# Altium schematic sheet Sheet_1_2024-01-01 (1).schdoc
size 310 x 219 mm
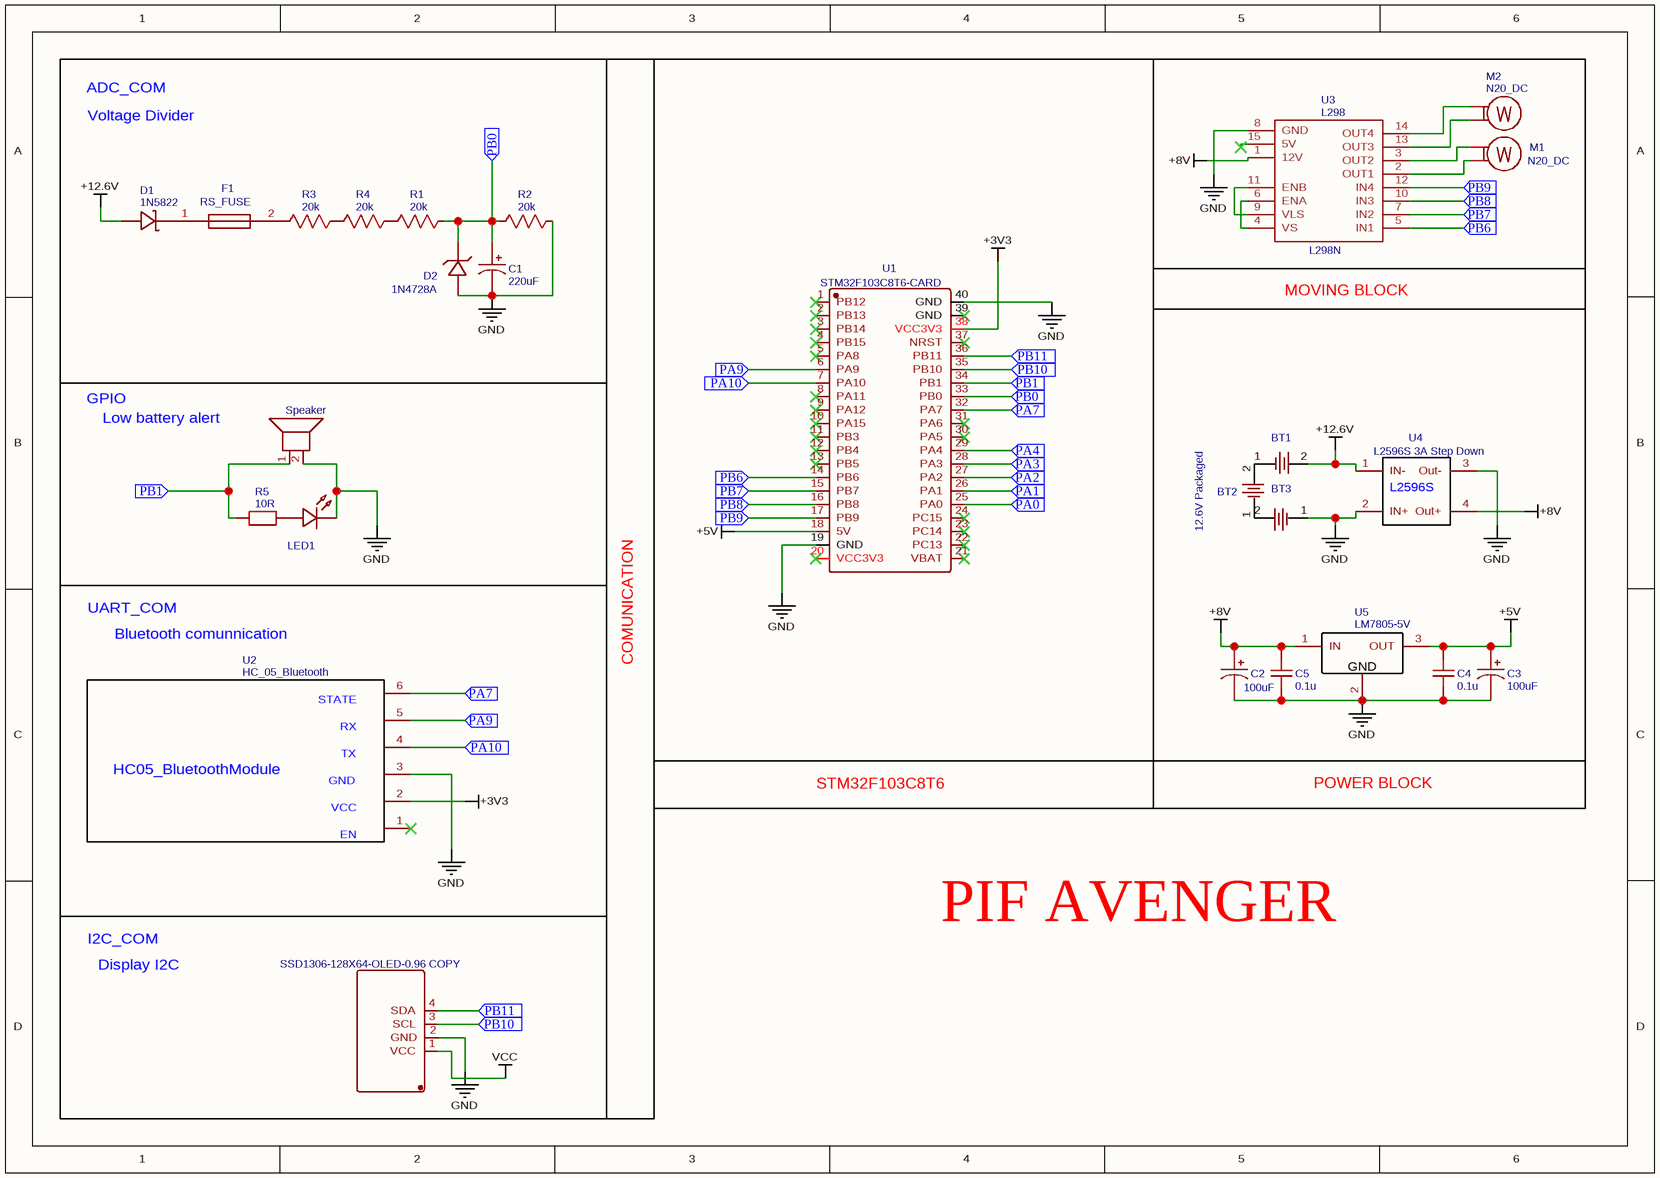
[diagram p0: Sheet_1_2024-01-01 (1).schdoc]

## Parts
BT1  BH-18650-A1AJ006  [BAT-TH_BH-18650-A1AJ006]  (value not drawn)
BT2  12.6V Packaged  [BAT-TH_BH-18650-A1AJ006]
BT3  BH-18650-A1AJ006  [BAT-TH_BH-18650-A1AJ006]  (value not drawn)
C1  220uF  [CAP-D4.0×F1.5]
C2  100uF  [CAP-D4.0×F1.5]
C3  100uF  [CAP-D4.0×F1.5]
C4  0.1u  [C0603]
C5  0.1u  [C0603]
D1  1N5822  [DO-201AD_BD5.3-L8.4-P12.50-D1.4-FD]
D2  1N4728A  [DO-41_BD2.4-L4.7-P8.70-D0.9-RD]
F1  RS_FUSE  [FUSE-TH-L12.5-W2.0-P5.00-D0.8]
LED1  LED-0603_R  [LED0603_RED]  (value not drawn)
LS1  Speaker  [SPEAKER-PADS]
M1  N20_DC
M2  N20_DC
PCB1  SSD1306-128X64-OLED-0.96 COPY  [SSD1306]
R1  20k  [R0603]
R2  20k  [R0603]
R3  20k  [R0603]
R4  20k  [R0603]
R5  10R  [R0603]
U1  STM32F103C8T6-CARD  [CONN-TH_L53.3-W22.9_STM32F103C8T6-CARD]
U2  HC_05_Bluetooth
U3  L298  [L298N]
U4  L2596S 3A Step Down  [L2596S STEPDOWN 3A MODUL]
U5  LM7805-5V  [TO-252-2_L6.6-W6.1-P4.58-LS9.9-TL]

## Blocks framed on the sheet
MOVING BLOCK: BT1-BT3 C2-C5 U4 U5

## Ports
PA0 (in), PA1 (in), PA2 (in), PA3 (in), PA4 (in), PA7 (in), PA9 (in), PA10 (in), PB0 (in), PB1 (in), PB6 (in), PB7 (in), PB8 (in), PB9 (in), PB10 (in), PB11 (in)

## Nets
+3V3: U1.38(VCC3V3) U2.2
+5V: C3.1 C4.2 U1.18(5V) U5.3(OUT)
+8V: C2.1 C5.2 U3.1(12V) U4.4(Out+) U5.1(IN)
+12.6V: BT1.2 D1.1(A) U4.1(IN-)
GND: BT3.1 C1.2 C2.2 C3.2 C4.1 C5.1 D2.2(A) LED1.2 LS1.2 PCB1.2(GND) R2.2 U1.19(GND) U1.40(GND) U2.3 U3.8(GND) U4.2(IN+) U4.3(Out-) U5.2(GND)
VCC: PCB1.1(VCC)
PA0: U1.25(PA0) ; port PA0
PA1: U1.26(PA1) ; port PA1
PA2: U1.27(PA2) ; port PA2
PA3: U1.28(PA3) ; port PA3
PA4: U1.29(PA4) ; port PA4
PA7: U1.32(PA7) U2.6 ; port PA7
PA9: U1.6(PA9) U2.5 ; port PA9
PA10: U1.7(PA10) U2.4 ; port PA10
PB0: C1.1 D2.1(K) R1.2 R2.1 U1.33(PB0) ; port PB0
PB1: LS1.1 R5.1 U1.34(PB1) ; port PB1
PB6: U1.14(PB6) U3.5(IN1) ; port PB6
PB7: U1.15(PB7) U3.7(IN2) ; port PB7
PB8: U1.16(PB8) U3.10(IN3) ; port PB8
PB9: U1.17(PB9) U3.12(IN4) ; port PB9
PB10: PCB1.3(SCL) U1.35(PB10) ; port PB10
PB11: PCB1.4(SDA) U1.36(PB11) ; port PB11
NetBT1_1: BT1.1 BT2.2
NetBT2_1: BT2.1 BT3.2
NetD1_2: D1.2(K) F1.1
NetF1_2: F1.2 R3.1
NetM1_1: M1.1(-) U3.3(OUT2)
NetM1_2: M1.2(+) U3.2(OUT1)
NetM2_1: M2.1(-) U3.14(OUT4)
NetM2_2: M2.2(+) U3.13(OUT3)
NetR1_1: R1.1 R4.2
NetR3_2: R3.2 R4.1
NetU3_4: U3.4(VS) U3.6(ENA)
NetU3_9: U3.9(VLS) U3.11(ENB)

Not connected (* = marked no-connect by the designer): LED1 1; R5 2; U1 1(PB12)* 2(PB13)* 3(PB14)* 4(PB15)* 5(PA8)* 8(PA11)* 9(PA12)* 10(PA15)* 11(PB3)* 12(PB4)* 13(PB5)* 20(VCC3V3)* 21(VBAT)* 22(PC13)* 23(PC14)* 24(PC15)* 30(PA5)* 31(PA6)* 37(NRST)* 39(GND)*; U2 1*; U3 15(5V)*

## Notes on the sheet
- Voltage Divider
- ADC_COM
- GPIO
- Low battery alert
- COMUNICATION
- UART_COM
- Bluetooth comunnication
- STM32F103C8T6
- POWER BLOCK
- I2C_COM
- Display I2C
- PIF AVENGER
- (in symbol HC_05_Bluetooth) STATE; RX; TX; HC05_BluetoothModule; GND; VCC; EN
- (in symbol L298) L298N
- (in symbol L2596S 3A Step Down) L2596S

## Library data of the parts
BT1 BT3 = BH-18650-A1AJ006: Manufacturer: MYOUNG(美阳); Contributor: lcsc; Supplier: LCSC; Supplier Part: C5290175; Manufacturer Part: BH-18650-A1AJ006; JLCPCB Part Class: Extended Part; spicePre: B; spiceSymbolName: BH-18650-A1AJ006
BT2 = 12.6V Packaged: Manufacturer: MYOUNG(美阳); Manufacturer Part: BH-18650-A1AJ006; Contributor: lcsc; Supplier: LCSC; Supplier Part: C5290175; JLCPCB Part Class: Extended Part; spicePre: B; spiceSymbolName: BH-18650-A1AJ006
C1 = 220uF: nameAlias: Value(F); Contributor: LCEDA_Lib; spicePre: C; spiceSymbolName: CE_TH_D4.0×F1.5_US
C2 C3 = 100uF: nameAlias: Value(F); Contributor: LCEDA_Lib; spicePre: C; spiceSymbolName: CE_TH_D4.0×F1.5_US
C4 C5 = 0.1u: nameAlias: Value(F); Contributor: LCEDA_Lib; spicePre: C; spiceSymbolName: C_0603_US
D1 = 1N5822: Manufacturer: MDD; Supplier: LCSC; Manufacturer Part: 1N5822; Supplier Part: C2476; JLCPCB Part Class: Extended Part; spicePre: D; spiceSymbolName: 1N5822
D2 = 1N4728A: Manufacturer: onsemi(安森美); Contributor: LCSC; Supplier: LCSC; Supplier Part: C140852; Manufacturer Part: 1N4728A; JLCPCB Part Class: Extended Part; spicePre: D; spiceSymbolName: 1N4728A_C140852
F1 = RS_FUSE: Manufacturer: null; Manufacturer Part: ResettableFuse-500mA; Contributor: LCSC; Supplier: LCSC; Supplier Part: C9900007669; JLCPCB Part Class: Extended Part; spicePre: U; spiceSymbolName: RESETTABLEFUSE-500MA
LED1 = LED-0603_R: Manufacturer: EVERLIGHT(台湾亿光); Manufacturer Part: 19-217/R6C-AL1M2VY/3T; Contributor: LCEDA_01; Supplier Part: C72044; Supplier: LCSC; spicePre: L; spiceSymbolName: LED-0603_R
LS1 = Speaker: Contributor: virtualgt; license: https://www.gnu.org/licenses/lgpl-2.1.html; spicePre: L; spiceSymbolName: Speaker
M1 M2 = N20_DC: Contributor: crypt-pcb; Supplier: CryptPCB; spicePre: U; spiceSymbolName: N20_DC
PCB1 = SSD1306-128X64-OLED-0.96 COPY: sourceId: wICUcuL3l; spicePre: X; timeStamp: 1456014235; spiceSymbolName: SSD1306-128X64-OLED-0.96 COPY
R1-R4 = 20k: nameAlias: Value(Ω); Contributor: LCEDA_Lib; spicePre: R; spiceSymbolName: R_0603_US
R5 = 10R: nameAlias: Value(Ω); Contributor: LCEDA_Lib; spicePre: R; spiceSymbolName: R_0603_EU
U1 = STM32F103C8T6-CARD: Manufacturer: null; Contributor: lcsc; Supplier: LCSC; Supplier Part: C9900077949; Manufacturer Part: STM32F103C8T6-Card; spicePre: U; spiceSymbolName: STM32F103C8T6-CARD
U2 = HC_05_Bluetooth: Contributor: Crypt-PCB; Supplier: CryptPCB; spicePre: U; spiceSymbolName: HC_05_Bluetooth
U3 = L298: Manufacturer Part: L298N Driver; Contributor: huynhthienphu2492001; Supplier: SeeedStudio; spicePre: U; spiceSymbolName: L298
U4 = L2596S 3A Step Down: Contributor: St1fT; Manufacturer Part: L2596S 3A Step Down; spicePre: U; spiceSymbolName: L2596S 3A Step Down
U5 = LM7805-5V: Manufacturer: null; Contributor: LCSC; Supplier: LCSC; Supplier Part: C9900008050; Manufacturer Part: LM7805-5V; JLCPCB Part Class: Extended Part; spicePre: U; spiceSymbolName: LM7805-5V